# EAGLE design FLC100_remote_HV_v1 (EAGLE 6.4)
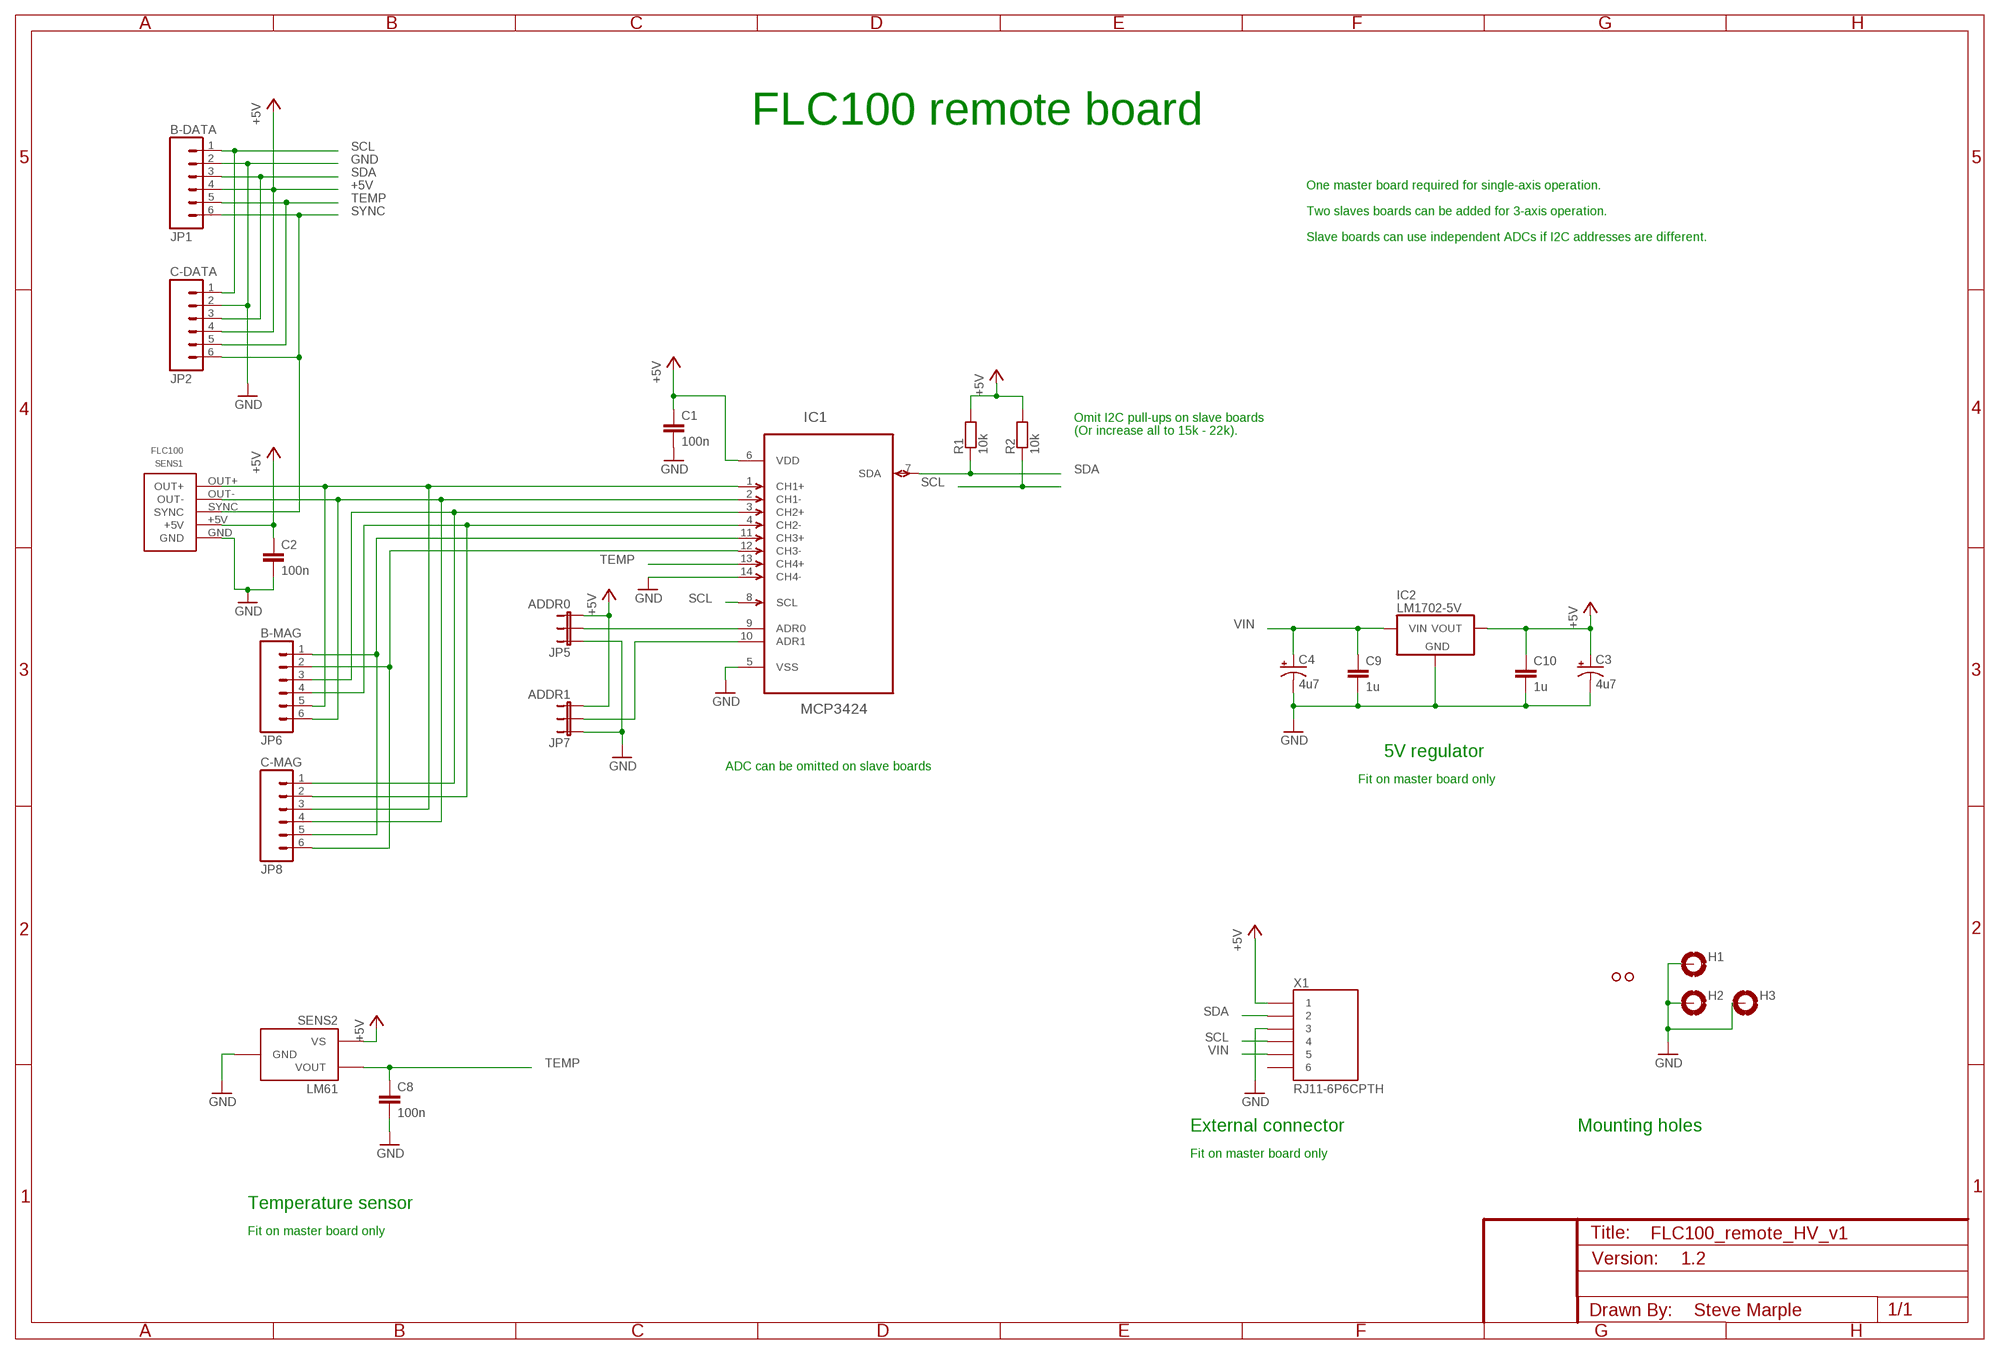
[diagram p0: schematic, sheet 1]

## Parts
C1  100n  CAPPTH  [CAP-PTH-SMALL]
C2  100n  CAPPTH  [CAP-PTH-SMALL]
C3  4u7  CAP_POLPTH2  [CPOL-RADIAL-10UF-25V]
C4  4u7  CAP_POLPTH2  [CPOL-RADIAL-10UF-25V]
C8  100n  CAPPTH  [CAP-PTH-SMALL]
C9  1u  CAPPTH1  [CAP-PTH-5MM]
C10  1u  CAPPTH1  [CAP-PTH-5MM]
H1  MOUNT-PAD-ROUND3.0  [3,0-PAD]
H2  MOUNT-PAD-ROUND3.0  [3,0-PAD]
H3  MOUNT-PAD-ROUND3.0  [3,0-PAD]
IC1  MCP3424  MCP3424-E/SLSO14-HAND  [SO14-HAND]
IC2  LM1702-5V  LM1702  [TO-92@2]
JP1  B-DATA  M06FEMALE  [1X06_FEMALE]
JP2  C-DATA  M06FEMALE  [1X06_FEMALE]
JP5  ADDR0  JUMPER-3PTH  [1X03]
JP6  B-MAG  M06FEMALE  [1X06_FEMALE]
JP7  ADDR1  JUMPER-3PTH  [1X03]
JP8  C-MAG  M06FEMALE  [1X06_FEMALE]
R1  10k  RESISTOR  [RES-AXIAL-0.4]
R2  10k  RESISTOR  [RES-AXIAL-0.4]
SENS1  FLC100  [FLC100]
SENS2  LM61  [TO-92]
U$1  PAD  [PAD]
U$2  PAD  [PAD]
X1  RJ11-6P6CPTH  [RJ11-6P6C]

## Nets
+5V [power]: C1.1 C2.1 C3.1(+) C10.1 IC1.6(VDD) IC2.3(VOUT) JP1.4 JP2.4 JP5.3 JP7.3 R1.P$2 R2.P$2 SENS1.+5V SENS2.1(VS) X1.1
ADDR0: IC1.9(ADR0) JP5.2
ADDR1: IC1.10(ADR1) JP7.2
CH1+: IC1.1(CH1+) JP6.5 JP8.3 SENS1.OUT+
CH1-: IC1.2(CH1-) JP6.6 JP8.4 SENS1.OUT-
CH2+: IC1.3(CH2+) JP6.3 JP8.1
CH2-: IC1.4(CH2-) JP6.4 JP8.2
CH3+: IC1.11(CH3+) JP6.1 JP8.5
CH3-: IC1.12(CH3-) JP6.2 JP8.6
GND [power]: C1.2 C2.2 C3.2(-) C4.2(-) C8.2 C9.2 C10.2 H1.B3,0(MOUNT) H2.B3,0(MOUNT) H3.B3,0(MOUNT) IC1.5(VSS) IC1.14(CH4-) IC2.1(GND) JP1.2 JP2.2 JP5.1 JP7.1 SENS1.GND SENS2.3(GND) X1.3
SCL: IC1.8(SCL) JP1.1 JP2.1 R2.P$1 X1.4
SDA: IC1.7(SDA) JP1.3 JP2.3 R1.P$1 X1.2
SYNC: JP1.6 JP2.6 SENS1.SYNC
TEMP: C8.1 IC1.13(CH4+) JP1.5 JP2.5 SENS2.2(VOUT)
VIN [power]: C4.1(+) C9.1 IC2.2(VIN) X1.5
Unconnected: U$1.1 U$2.1 X1.6

## Notes on the sheet
- FLC100 remote board
- One master board required for single-axis operation.
- Two slaves boards can be added for 3-axis operation.
- Slave boards can use independent ADCs if I2C addresses are different.
- Omit I2C pull-ups on slave boards
- (Or increase all to 15k - 22k).
- 5V regulator
- ADC can be omitted on slave boards
- Fit on master board only
- External connector | Mounting holes
- Fit on master board only
- Temperature sensor
- Fit on master board only
- 1.2
- Steve Marple

## Library data of the parts
C1 C2 C8-C10 = SparkFun:CAP: Capacitor Standard 0603 ceramic capacitor, and 0.1" leaded capacitor.
C3 C4 = SparkFun:CAP_POL: Capacitor Polarized These are standard SMD and PTH capacitors. Normally 10uF, 47uF, and 100uF in electrolytic and tantalum varieties. Always verify the external diameter of the through hole cap, it varies with capacity, voltage, and manufacturer. The EIA devices should be standard.
H1-H3 = holes:MOUNT-PAD-ROUND: MOUNTING PAD, round
IC1 = SteveMarple:MCP3424-E/SL: Analog-to-Digital Converter Footprint adapted from Eagle file from Onecall web site
IC2 = SteveMarple:LM1702
JP1 JP2 JP6 JP8 = SteveMarple:M06: Header 6 Standard 6-pin 0.1" header. Use with straight break away headers (SKU : PRT-00116), right angle break away headers (PRT-00553), swiss pins (PRT-00743), machine pins (PRT-00117), and female headers (PRT-00115). Molex polarized connector foot print use with SKU : PRT-08094 with associated crimp pins and housings. NOTES ON THE VARIANTS LOCK and LOCK_LONGPADS... This footprint was designed to help hold the alignment of a through-hole component (i.e. 6-pin header) while soldering it into place. You may notice that each hole has been shifted either up or down by 0.005 of an inch from it's more standard position (which is a perfectly straight line). This slight alteration caused the pins (the squares in the middle) to touch the edges of the holes. Because they are alternating, it causes a "brace" to hold the component in place. 0.005 has proven to be the perfect amount of "off-center" position when using our standard breakaway headers. Although looks a little odd when you look at the bare footprint, once you have a header in there, the alteration is very hard to notice. Also, if you push a header all the way into place, it is covered up entirely on the bottom side. This idea of altering the position of holes to aid alignment will be further integrated into the Sparkfun Library for other footprints. It can help hold any component with 3 or more connection pins.
JP5 JP7 = SparkFun:JUMPER-3
R1 R2 = SteveMarple:RESISTOR: 1/4W PTH resistor
SENS1 = SteveMarple:FLC100: Stefan Mayer Instruments FLC100 fluxgate magnetometer sensor
SENS2 = SteveMarple:LM61
U$1 U$2 = SteveMarple:PAD
X1 = SteveMarple:RJ11-6P6C

## Net classes
1 power: width 0.381 mm

## Board
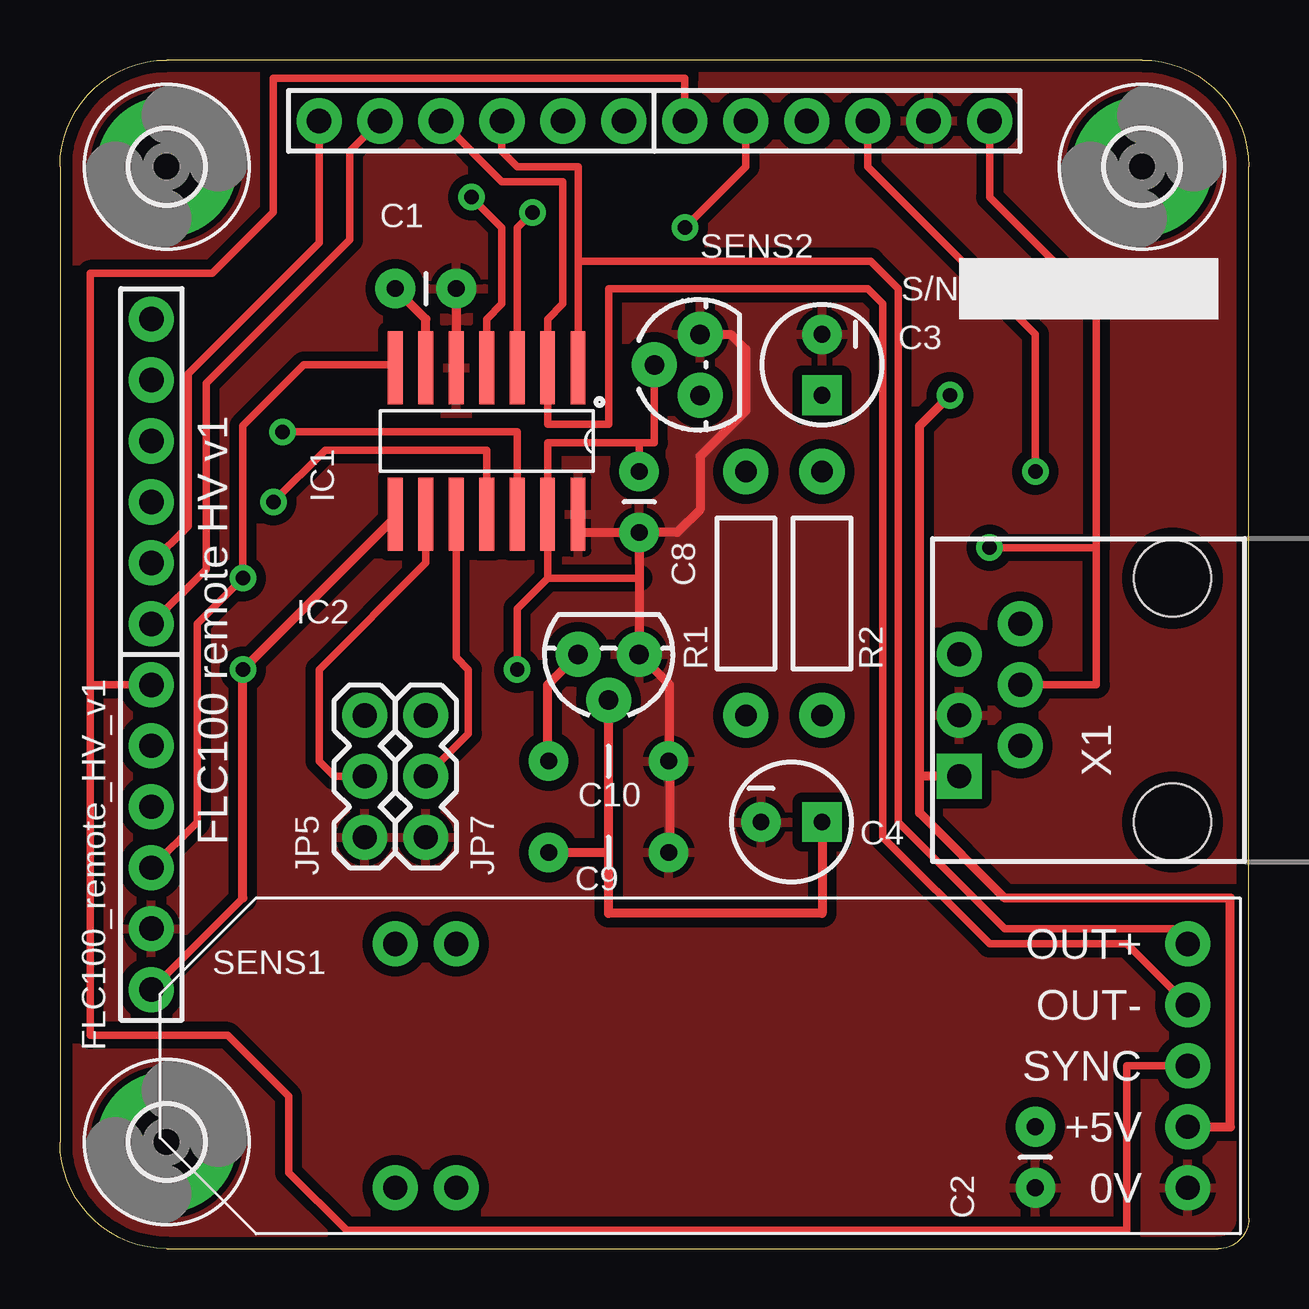
[diagram p1: board, top side]
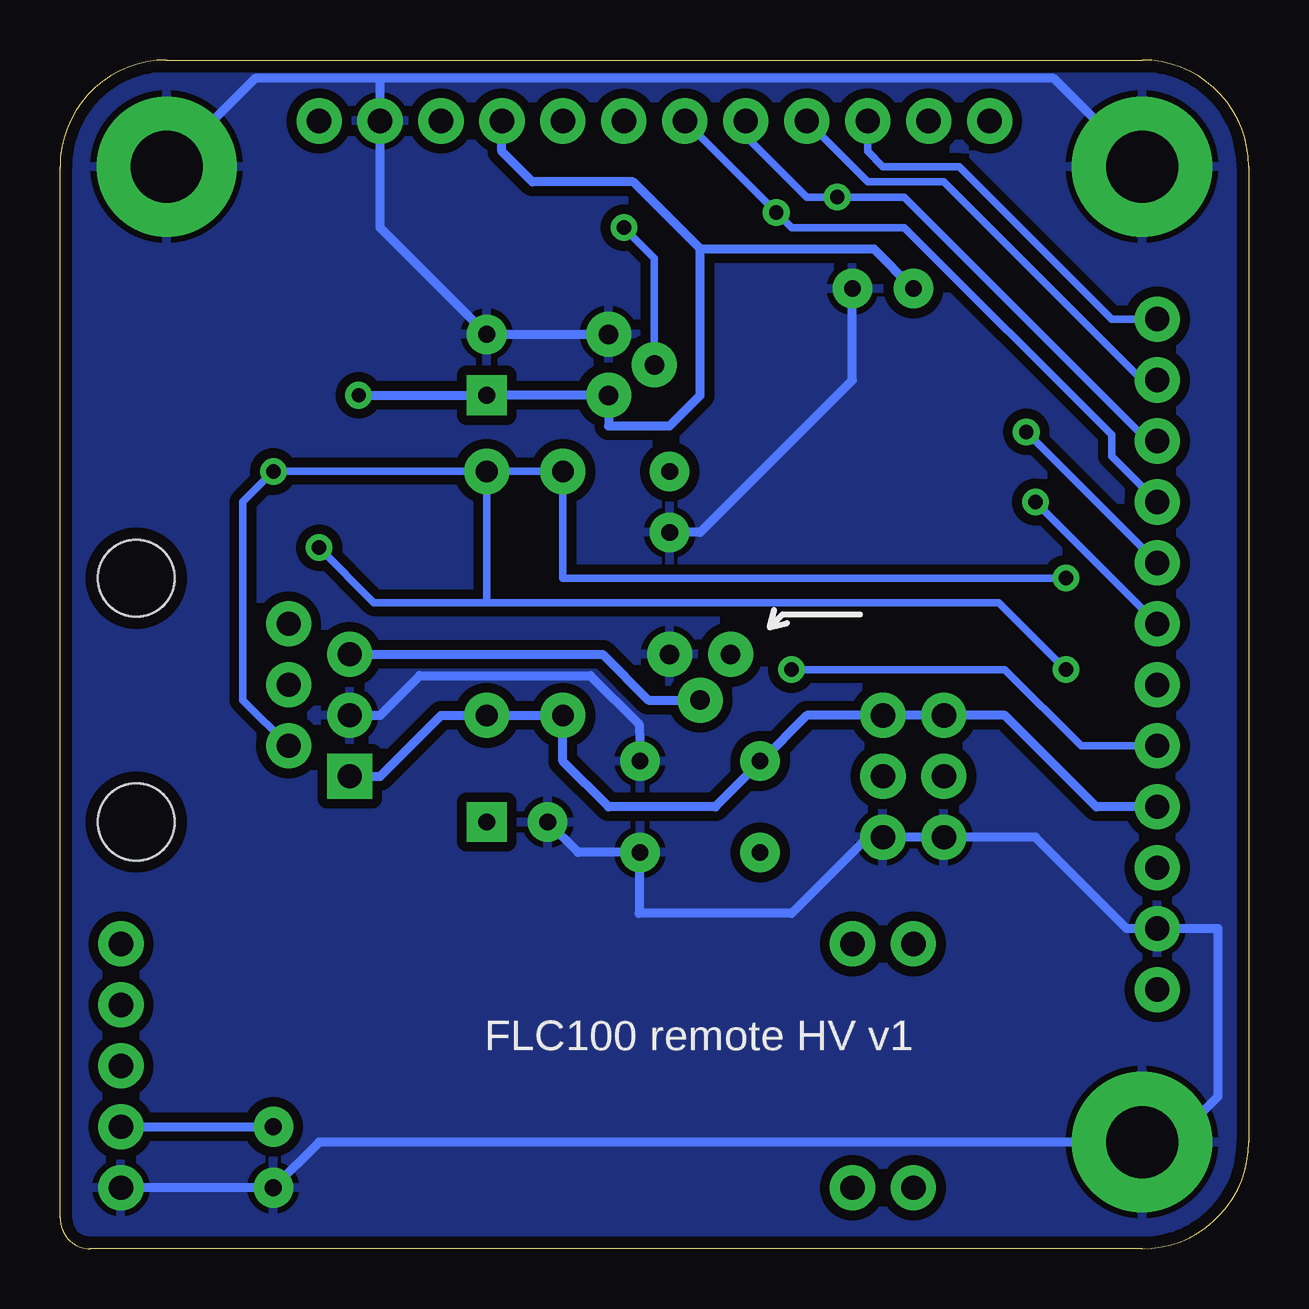
[diagram p2: board, bottom side, seen from below]

Size 49.53 x 49.53 mm. Coordinates in mm from the lower left corner, seen from the top.
Outline: 4.45,0 48.26,0 arc90 49.53,1.27 49.53,45.09 arc90 45.09,49.53 4.45,49.53 arc90 0,45.09 0,4.45 arc90 4.45,0
Copper layers (1*16): Top 0.035mm / dielectric 1.5mm / Bottom 0.035mm
Design rules "default": minimum track width 10mil, minimum drill 20mil, track to track 10mil, track to pad 10mil, pad to pad 10mil, via to via 10mil, smd to smd 10mil, copper to edge 0.5mm, drill to drill 8mil, minimum pad ring 12mil, minimum via ring 10mil, stop-mask expansion 4mil, vias tented up to drill 25mil, thermal gap 10mil

### Footprints (pad centres in the part's own frame; a part is rotated, then mirrored left to right if it is on the bottom)
CAP-PTH-SMALL = drill 0.7 pad 1.651: 1 0,0; 2 2.54,0
CPOL-RADIAL-10UF-25V = drill 0.7 pad 1.651 square: 1 1.27,0 | drill 0.7 pad 1.651: 2 -1.27,0
CAP-PTH-5MM = drill 0.7 pad 1.651: 1 -2.5,0; 2 2.5,0
3,0-PAD = drill 3 pad 5.842: B3,0 0,0
SO14-HAND = smd 0.61 x 3.048: 1 -3.81,-3.048; 2 -2.54,-3.048; 3 -1.27,-3.048; 4 0,-3.048; 5 1.27,-3.048; 6 2.54,-3.048; 7 3.81,-3.048; 8 3.81,3.048; 9 2.54,3.048; 10 1.27,3.048; 11 0,3.048; 12 -1.27,3.048; 13 -2.54,3.048; 14 -3.81,3.048
TO-92@2 = drill 0.813 pad 1.88: 1 -1.27,0; 2 0,1.905; 3 1.27,0
1X06_FEMALE = drill 1.016 pad 1.88: 1 0,0; 2 2.54,0; 3 5.08,0; 4 7.62,0; 5 10.16,0; 6 12.7,0
1X03 = drill 1.016 pad 1.88: 1 0,0; 2 2.54,0; 3 5.08,0
RES-AXIAL-0.4 = drill 0.9 pad 1.88: P$1 -5.08,0; P$2 5.08,0
FLC100 = drill 1.016 pad 1.88: +5V -20.32,2.54; GND -20.32,5.08; NC@0 12.7,5.08; NC@1 12.7,-5.08; OUT+ -20.32,-5.08; OUT- -20.32,-2.54; SYNC -20.32,0
TO-92 = drill 0.813 pad 1.88: 1 -1.27,0; 2 0,1.905; 3 1.27,0
PAD = drill 1.016 pad 1.88: 1 0,0
RJ11-6P6C = drill 1 pad 1.88 square: 1 -3.175,8.89 | drill 1 pad 1.88: 2 -1.905,6.35; 3 -0.635,8.89; 4 0.635,6.35; 5 1.905,8.89; 6 3.175,6.35 | hole 3.2: -5.08,0; 5.08,0

### Placement (x,y rotation side)
C1  13.97,40.01 0 top
C2  40.64,5.08 270 top
C3  31.75,36.83 270 top
C4  30.48,17.78 0 top
C8  24.13,32.38 270 top
C9  22.86,16.51 0 top
C10  22.86,20.32 0 top
H1  4.45,4.45 0 top
H2  45.09,45.09 0 top
H3  4.45,45.09 0 top
IC1  17.78,33.66 180 top
IC2  22.86,24.77 180 top
JP1  3.81,10.79 90 top
JP2  38.73,46.99 180 top
JP5  12.7,17.14 90 top
JP6  3.81,26.04 90 top
JP7  15.24,17.14 90 top
JP8  23.5,46.99 180 top
R1  28.57,27.3 270 top
R2  31.75,27.3 270 top
SENS1  26.67,7.62 180 top
SENS2  26.67,36.83 90 top
U$1  16.51,12.7 0 top
U$2  16.51,2.54 0 top
X1  46.35,22.86 90 top

### Tracks (layer width: path | path; a pad name or v marks a point on that pad's centre or on a via)
+5V  (via drill 0.6)
  Top 0.381: IC1.6 15.24,38.73 C1.1 | 35.81,19.68 35.81,18.16 39.37,14.61 48.77,14.61 48.77,5.08 SENS1.+5V | 35.81,19.68 35.81,34.29 v37.08,35.56 | X1.1 35.81,19.68 | IC2.3 20.32,23.5 20.32,20.95 C10.1
  Bottom 0.381: JP1.4 6.35,18.41 10.16,22.23 JP5.3 JP7.3 18.41,22.23 20.32,20.32 C10.1 20.64,20 22.23,18.41 26.67,18.41 28.57,20.32 R1.P$2 R2.P$2 33.66,22.23 36.2,19.68 X1.1 | 22.86,41.66 25.65,44.45 29.84,44.45 31.11,45.72 JP2.4 | 22.86,41.66 15.62,41.66 C1.1 | v37.08,35.56 C3.1 SENS2.1 26.67,34.29 24.13,34.29 22.86,35.56 22.86,41.66 | SENS1.+5V C2.1
ADDR0
  Top 0.305: JP5.2 11.43,19.68 10.79,20.32 10.79,24.13 15.24,28.57 IC1.9
ADDR1
  Top 0.305: JP7.2 17.02,21.46 17.02,24.13 16.51,24.64 IC1.10
CH1+
  Top 0.305: 21.59,41.15 21.59,45.09 19.05,45.09 18.41,45.72 JP8.3 | SENS1.OUT+ 46.35,13.34 39.37,13.34 34.92,17.78 34.92,40.01 33.78,41.15 21.59,41.15 | 21.59,41.15 IC1.1
  Bottom 0.305: JP6.5 4.45,36.2 12.7,44.45 15.88,44.45 JP8.3
CH1-
  Top 0.305: JP8.4 18.41,44.45 20.95,44.45 20.95,39.37 20.32,38.73 IC1.2 20.32,34.35 22.86,34.35 22.86,40.01 33.66,40.01 34.29,39.37 34.29,17.14 38.73,12.7 44.45,12.7 SENS1.OUT-
  Bottom 0.305: JP6.6 5.71,38.73 12.06,45.09 15.24,45.09 15.88,45.72 JP8.4
CH2+  (via drill 0.6)
  Top 0.305: v19.68,43.18 19.05,42.55 IC1.3
  Bottom 0.305: JP6.3 5.71,33.02 5.71,33.91 14.35,42.55 19.05,42.55 v19.68,43.18 JP8.1
CH2-  (via drill 0.6)
  Top 0.305: IC1.4 17.78,38.73 18.41,39.37 18.41,42.55 v17.14,43.81
  Bottom 0.305: JP6.4 4.19,33.66 14.35,43.81 v17.14,43.81 18.41,43.81 20.95,46.35 JP8.2
CH3+  (via drill 0.6)
  Top 0.305: JP6.1 6.1,28.32 6.1,36.07 12.06,42.04 12.06,45.72 JP8.5 | IC1.11 17.78,33.27 11.05,33.27 v8.89,31.11
  Bottom 0.305: v8.89,31.11 JP6.1
CH3-  (via drill 0.6)
  Top 0.305: JP8.6 10.79,41.91 5.33,36.45 5.33,30.1 JP6.2 | IC1.12 19.05,34.04 v9.27,34.04
  Bottom 0.305: v9.27,34.04 JP6.2
GND
  Top 0.381: C1.2 IC1.5 | SENS2.3 27.94,38.1 28.57,37.47 28.57,34.92 26.67,33.02 26.67,30.8 25.72,29.84 C8.2 | C8.2 IC2.1 | 25.4,20.32 25.36,20.36 C10.2 25.4,20.32 | 25.4,20.32 25.4,16.51 C9.2 | IC1.14 21.59,29.84 C8.2 | 25.4,20.32 25.4,23.5 IC2.1 | 24.09,24.8 IC2.1
  Bottom 0.381: H3.B3,0 8.13,48.77 36.2,48.77 | 36.2,48.77 41.4,48.77 H2.B3,0 | SENS2.3 C3.2 36.2,42.55 JP2.2 36.2,48.77 | C1.2 16.51,36.2 22.86,29.84 C8.2 | SENS1.GND C2.2 38.73,4.45 H1.B3,0 3.17,4.45 1.27,6.35 1.27,13.34 JP1.2 5.08,13.34 8.89,17.14 JP5.1 JP7.1 15.88,17.14 19.05,13.97 25.4,13.97 25.4,16.47 | 25.4,16.47 C9.2 | X1.3 36.2,22.23 34.54,23.88 27.43,23.88 25.4,21.84 C10.2 | 25.4,16.47 25.36,16.47 25.4,16.51 27.94,16.51 C4.2
  pour Bottom (isolate 0.406): -1.27,-1.27 -1.27,50.8 50.8,50.8 50.8,-1.27
  pour Top (isolate 0.406): -2.54,52.07 52.07,52.07 52.07,-2.54 -2.54,-2.54
SCL  (via drill 0.6)
  Top 0.305: JP1.1 7.62,14.61 | 13.97,30.48 IC1.8 | JP2.1 38.73,43.81 43.18,39.37 43.18,29.21 | 43.18,29.21 v38.73,29.21 | X1.4 43.18,23.5 43.18,29.21
  Top 0.381: 7.62,14.61 v7.62,24.13 13.97,30.48
  Bottom 0.305: v38.73,29.21 36.45,26.92 31.75,26.92 | 31.75,26.92 10.41,26.92 v7.62,24.13 | R2.P$1 31.75,26.92
SDA  (via drill 0.6)
  Top 0.305: IC1.7 13.97,36.83 10.16,36.83 7.62,34.29 v7.62,27.94 5.71,26.04 5.71,17.78 JP1.3 | JP2.3 33.66,45.09 40.64,38.1 v40.64,32.38
  Bottom 0.305: v7.62,27.94 28.57,27.94 R1.P$1 v40.64,32.38 41.91,31.11 41.91,22.86 X1.2
SYNC
  Top 0.305: 1.27,23.5 1.27,40.64 6.35,40.64 8.89,43.18 8.89,48.77 26.04,48.77 JP2.6 | 1.27,23.5 JP1.6 | SENS1.SYNC 44.45,7.62 44.45,0.76 11.94,0.76 9.53,3.17 9.53,6.35 6.99,8.89 1.27,8.89 1.27,23.5
TEMP  (via drill 0.6)
  Top 0.305: v19.05,24.13 19.05,26.67 20.32,27.94 | JP2.5 28.57,45.09 v26.04,42.55 | 24.13,27.94 20.32,27.94 | 20.32,27.94 IC1.13 20.32,33.59 24.13,33.59 | 24.13,33.59 24.77,33.59 SENS2.2 | C8.1 24.13,33.59
  Bottom 0.305: JP1.5 6.99,20.95 10.16,24.13 v19.05,24.13 | SENS2.2 24.77,41.27 v26.04,42.55
VIN
  Top 0.381: C9.1 22.86,16.51 | 22.86,16.51 IC2.2 | C4.1 31.75,13.97 22.86,13.97 22.86,16.51
  Bottom 0.381: IC2.2 25.02,22.86 26.92,24.77 X1.5

### Text on the board
_tsilk: S/N | FLC100 remote HV v1
_bsilk: FLC100 remote HV v1